# Altium project NBP6 Altera Stratix BGA780 Rev1.00.PrjPcb
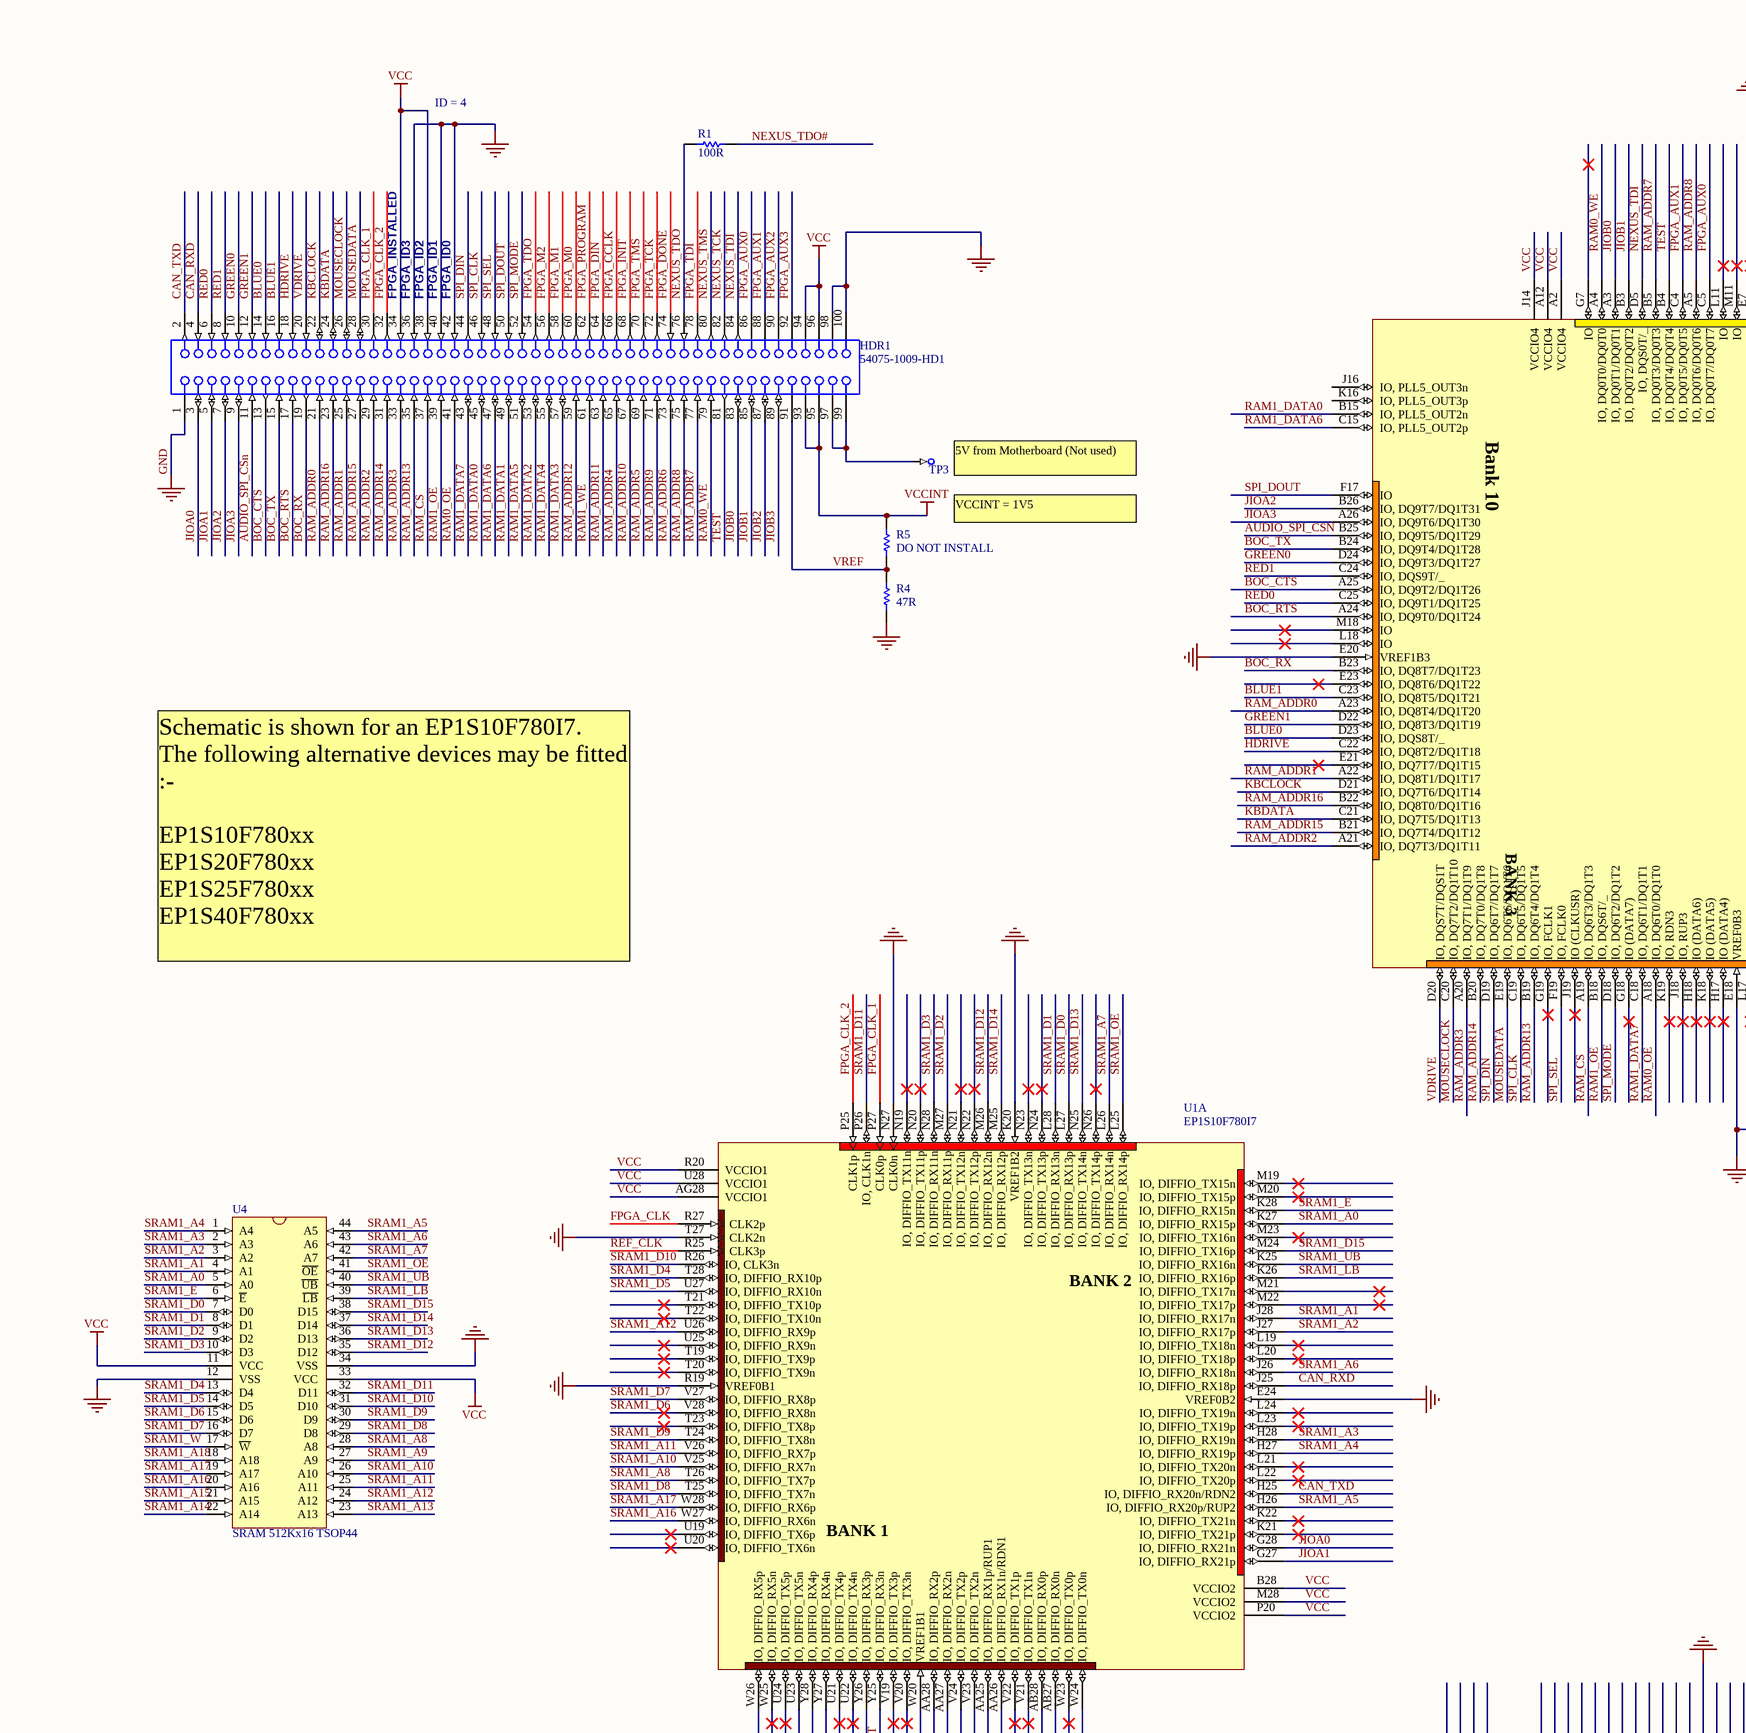
[diagram p0: NBP6 Altera Stratix BGA780 Rev1.00.SchDoc, top left]
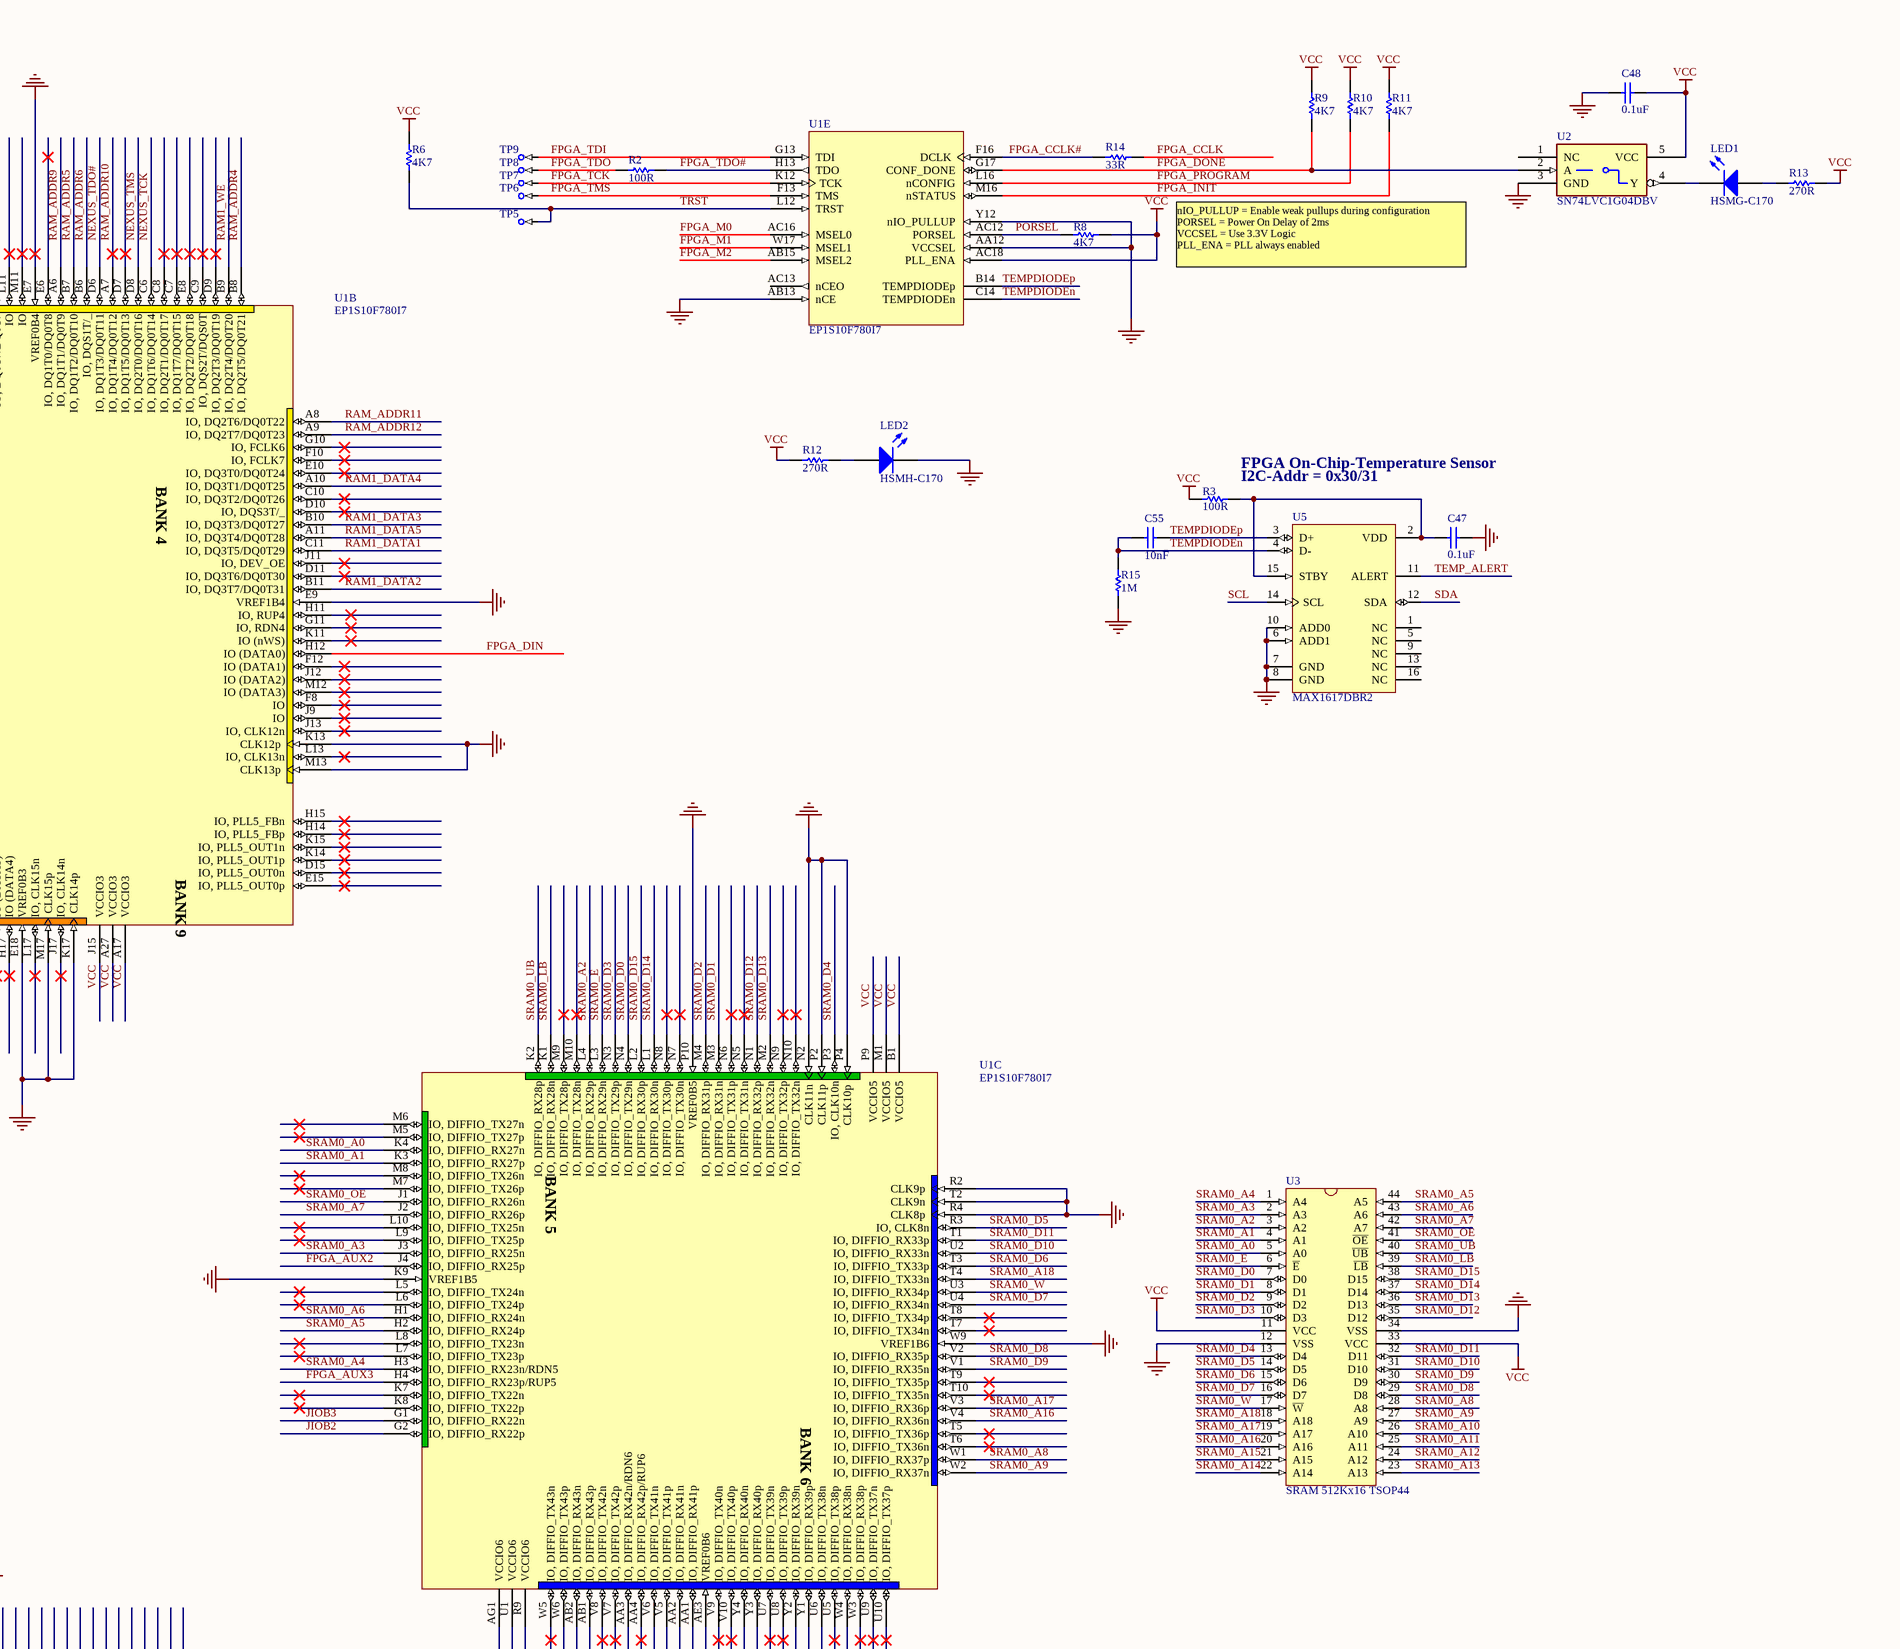
[diagram p1: NBP6 Altera Stratix BGA780 Rev1.00.SchDoc, top right]
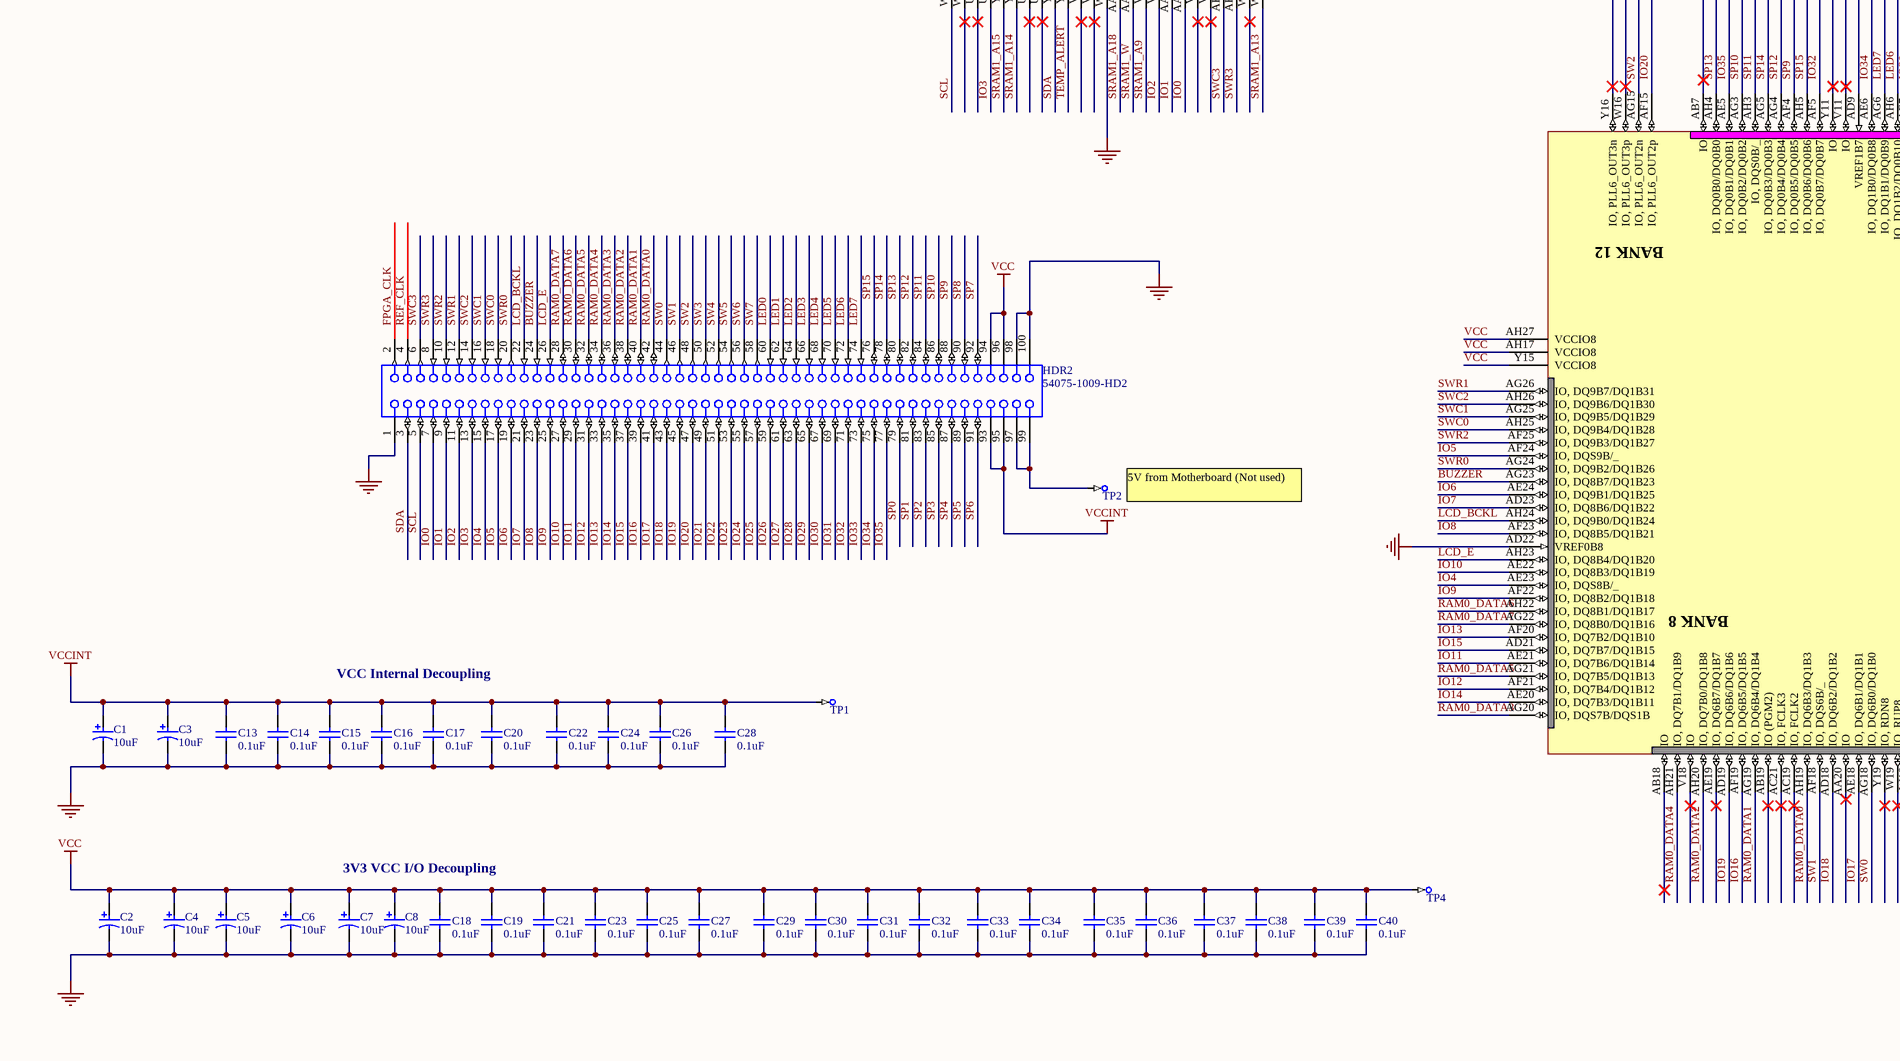
[diagram p2: NBP6 Altera Stratix BGA780 Rev1.00.SchDoc, bottom left]
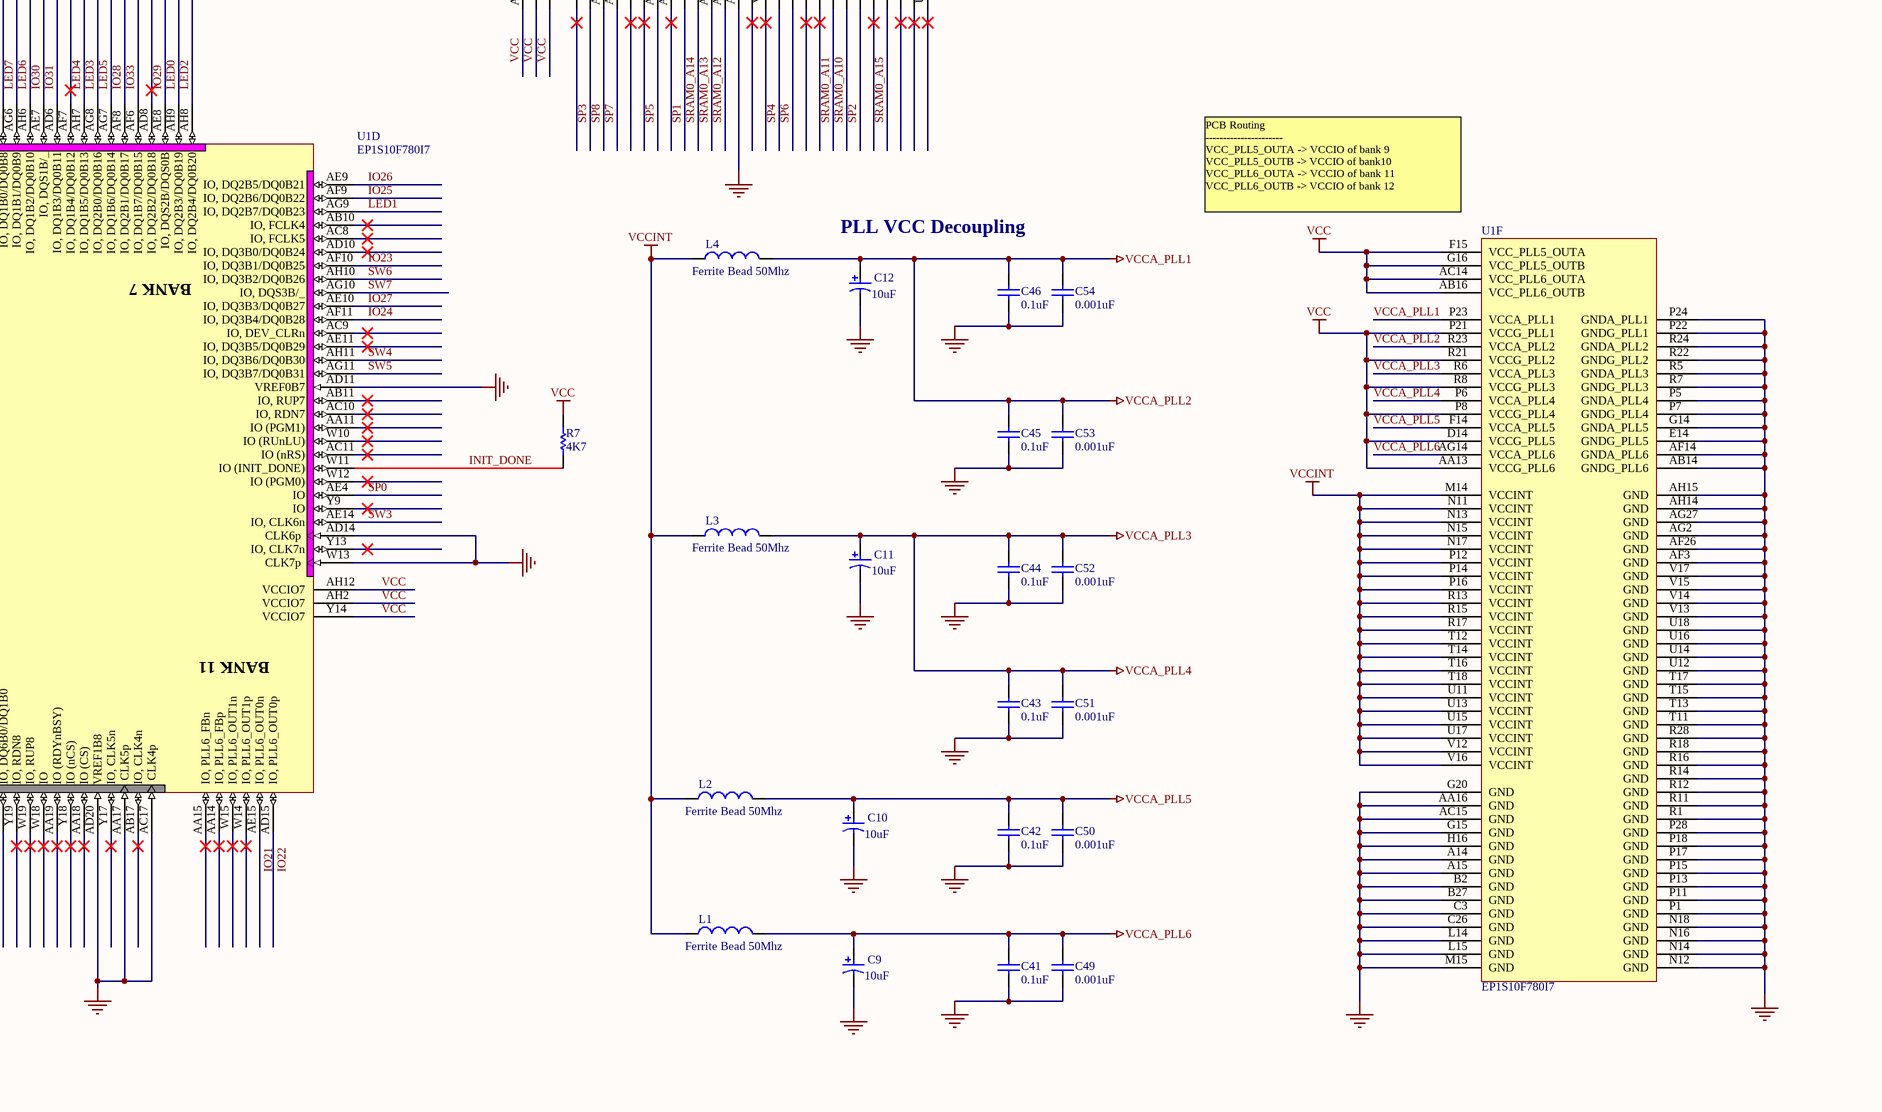
[diagram p3: NBP6 Altera Stratix BGA780 Rev1.00.SchDoc, bottom right]
1 sheet, 92 parts. Net scope: global (net labels, ports and power ports of the same name join across sheets).
Board file: NBP6 Altera Stratix BGA780 Rev1.00.PcbDoc

## Sheet NBP6 Altera Stratix BGA780 Rev1.00.SchDoc: Cyclone EP1C12 Daughterboard
size A1; Organization: Altium Limited; Address1: L3, 12a Rodborough Rd; Address2: Frenchs Forest; Address3: NSW; Address4: Australia 2086; DocumentNumber: 1; Revision: 1.02; SheetNumber: 1; SheetTotal: 1

### Parts
C1  10uF  [MCCT-B]
C2  10uF  [MCCT-B]
C3  10uF  [MCCT-B]
C4  10uF  [MCCT-B]
C5  10uF  [MCCT-B]
C6  10uF  [MCCT-B]
C7  10uF  [MCCT-B]
C8  10uF  [MCCT-B]
C9  10uF  [MCCT-B]
C10  10uF  [MCCT-B]
C11  10uF  [MCCT-B]
C12  10uF  [MCCT-B]
C13  0.1uF  [CC2012-0805]
C14  0.1uF  [CC2012-0805]
C15  0.1uF  [CC2012-0805]
C16  0.1uF  [CC2012-0805]
C17  0.1uF  [CC2012-0805]
C18  0.1uF  [CC2012-0805]
C19  0.1uF  [CC2012-0805]
C20  0.1uF  [CC2012-0805]
C21  0.1uF  [CC2012-0805]
C22  0.1uF  [CC2012-0805]
C23  0.1uF  [CC2012-0805]
C24  0.1uF  [CC2012-0805]
C25  0.1uF  [CC2012-0805]
C26  0.1uF  [CC2012-0805]
C27  0.1uF  [CC2012-0805]
C28  0.1uF  [CC2012-0805]
C29  0.1uF  [CC2012-0805]
C30  0.1uF  [CC2012-0805]
C31  0.1uF  [CC2012-0805]
C32  0.1uF  [CC2012-0805]
C33  0.1uF  [CC2012-0805]
C34  0.1uF  [CC2012-0805]
C35  0.1uF  [CC2012-0805]
C36  0.1uF  [CC2012-0805]
C37  0.1uF  [CC2012-0805]
C38  0.1uF  [CC2012-0805]
C39  0.1uF  [CC2012-0805]
C40  0.1uF  [CC2012-0805]
C41  0.1uF  [CC2012-0805]
C42  0.1uF  [CC2012-0805]
C43  0.1uF  [CC2012-0805]
C44  0.1uF  [CC2012-0805]
C45  0.1uF  [CC2012-0805]
C46  0.1uF  [CC2012-0805]
C47  0.1uF  [CC2012-0805]
C48  0.1uF  [CC2012-0805]
C49  0.001uF  [CC2012-0805]
C50  0.001uF  [CC2012-0805]
C51  0.001uF  [CC2012-0805]
C52  0.001uF  [CC2012-0805]
C53  0.001uF  [CC2012-0805]
C54  0.001uF  [CC2012-0805]
C55  10nF  [CC2012-0805]
HDR1  54075-1009-HD1  [54075]
HDR2  54075-1009-HD2  [54075]
L1  Ferrite Bead 50Mhz  [CC2012-0805]
L2  Ferrite Bead 50Mhz  [CC2012-0805]
L3  Ferrite Bead 50Mhz  [CC2012-0805]
L4  Ferrite Bead 50Mhz  [CC2012-0805]
LED1  HSMG-C170  [SMD _LED]
LED2  HSMH-C170  [SMD _LED]
R1  100R  [CC2012-0805]
R2  100R  [CC2012-0805]
R3  100R  [CC2012-0805]
R4  47R  [CC2012-0805]
R5  DO NOT INSTALL  [CC2012-0805]
R6  4K7  [CC2012-0805]
R7  4K7  [CC2012-0805]
R8  4K7  [CC2012-0805]
R9  4K7  [CC2012-0805]
R10  4K7  [CC2012-0805]
R11  4K7  [CC2012-0805]
R12  270R  [CC2012-0805]
R13  270R  [CC2012-0805]
R14  33R  [CC2012-0805]
R15  1M  [CC2012-0805]
TP1  TestPin  [TestPin]  (value not drawn)  (no BOM)
TP2  TestPin  [TestPin]  (value not drawn)  (no BOM)
TP3  TestPin  [TestPin]  (value not drawn)  (no BOM)
TP4  TestPin  [TestPin]  (value not drawn)  (no BOM)
TP5  TestPin  [TestPin]  (value not drawn)  (no BOM)
TP6  TestPin  [TestPin]  (value not drawn)  (no BOM)
TP7  TestPin  [TestPin]  (value not drawn)  (no BOM)
TP8  TestPin  [TestPin]  (value not drawn)  (no BOM)
TP9  TestPin  [TestPin]  (value not drawn)  (no BOM)
U1  EP1S10F780I7  [FBGA780]  (parts A,B,C,D,E,F of 7)
U2  SN74LVC1G04DBV  [SO-G5/P.95]
U3  SRAM 512Kx16 TSOP44  [SO-G44/P.8]
U4  SRAM 512Kx16 TSOP44  [SO-G44/P.8]
U5  MAX1617DBR2  [QSOP16]

### Nets
GND: C1.2 C2.2 C3.2 C4.2 C5.2 C6.2 C7.2 C8.2 C9.2 C10.2 C11.2 C12.2 C13.2 C14.2 C15.2 C16.2 C17.2 C18.2 C19.2 C20.2 C21.2 C22.2 C23.2 C24.2 C25.2 C26.2 C27.2 C28.2 C29.2 C30.2 C31.2 C32.2 C33.2 C34.2 C35.2 C36.2 C37.2 C38.2 C39.2 C40.2 C41.2 C42.2 C43.2 C44.2 C45.2 C46.2 C47.2 C48.2 C49.2 C50.2 C51.2 C52.2 C53.2 C54.2 HDR1.1 HDR1.36 HDR1.40 HDR1.42 HDR1.98 HDR1.100 HDR2.1 HDR2.98 HDR2.100 LED2.2(K) R4.2 R15.1 U1.A14(GND) U1.A15(GND) U1.AA12(VCCSEL) U1.AA16(GND) U1.AA17(CLK5p) U1.AB13(nCE) U1.AB14(GNDG_PLL6) U1.AC15(GND) U1.AC17(CLK4p) U1.AD9(VREF1B7) U1.AD11(VREF0B7) U1.AD14(CLK6p) U1.AD20(VREF1B8) U1.AD22(VREF0B8) U1.AE3(VREF0B6) U1.AF3(GND) U1.AF14(GNDA_PLL6) U1.AF26(GND) U1.AG2(GND) U1.AG27(GND) U1.AH14(GND) U1.AH15(GND) U1.B2(GND) U1.B27(GND) U1.C3(GND) U1.C26(GND) U1.E7(VREF0B4) U1.E9(VREF1B4) U1.E14(GNDG_PLL5) U1.E18(VREF0B3) U1.E20(VREF1B3) U1.E24(VREF0B2) U1.G14(GNDA_PLL5) U1.G15(GND) U1.G20(GND) U1.H16(GND) U1.K9(VREF1B5) U1.K13(CLK12p) U1.K17(CLK14p) U1.K20(VREF1B2) U1.L14(GND) U1.L15(GND) U1.M13(CLK13p) U1.M15(GND) U1.M17(CLK15p) U1.N2(CLK11n) U1.N12(GND) U1.N14(GND) U1.N16(GND) U1.N18(GND) U1.N27(CLK0n) U1.P1(GND) U1.P2(CLK11p) U1.P4(CLK10p) U1.P5(GNDA_PLL4) U1.P7(GNDG_PLL4) U1.P10(VREF0B5) U1.P11(GND) U1.P13(GND) U1.P15(GND) U1.P17(GND) U1.P18(GND) U1.P22(GNDG_PLL1) U1.P24(GNDA_PLL1) U1.P28(GND) U1.R1(GND) U1.R2(CLK9p) U1.R4(CLK8p) U1.R5(GNDA_PLL3) U1.R7(GNDG_PLL3) U1.R11(GND) U1.R12(GND) U1.R14(GND) U1.R16(GND) U1.R18(GND) U1.R19(VREF0B1) U1.R22(GNDG_PLL2) U1.R24(GNDA_PLL2) U1.R28(GND) U1.T2(CLK9n) U1.T11(GND) U1.T13(GND) U1.T15(GND) U1.T17(GND) U1.T27(CLK2n) U1.U12(GND) U1.U14(GND) U1.U16(GND) U1.U18(GND) U1.V13(GND) U1.V14(GND) U1.V15(GND) U1.V17(GND) U1.W9(VREF1B6) U1.W13(CLK7p) U1.W20(VREF1B1) U1.Y12(nIO_PULLUP) U2.3(GND) U3.12(VSS) U3.34(VSS) U4.12(VSS) U4.34(VSS) U5.6(ADD1) U5.7(GND) U5.8(GND) U5.10(ADD0)
VCC: C2.1 C4.1 C5.1 C6.1 C7.1 C8.1 C18.1 C19.1 C21.1 C23.1 C25.1 C27.1 C29.1 C30.1 C31.1 C32.1 C33.1 C34.1 C35.1 C36.1 C37.1 C38.1 C39.1 C40.1 C48.1 HDR1.34 HDR1.38 HDR1.94 HDR1.96 HDR2.94 HDR2.96 R3.1 R6.1 R7.1 R8.2 R9.1 R10.1 R11.1 R12.1 R13.1 TP4.1 U1.A2(VCCIO4) U1.A12(VCCIO4) U1.A17(VCCIO3) U1.A27(VCCIO3) U1.AA13(VCCG_PLL6) U1.AB16(VCC_PLL6_OUTB) U1.AC14(VCC_PLL6_OUTA) U1.AC18(PLL_ENA) U1.AG1(VCCIO6) U1.AG28(VCCIO1) U1.AH2(VCCIO7) U1.AH12(VCCIO7) U1.AH17(VCCIO8) U1.AH27(VCCIO8) U1.B1(VCCIO5) U1.B28(VCCIO2) U1.D14(VCCG_PLL5) U1.F15(VCC_PLL5_OUTA) U1.G16(VCC_PLL5_OUTB) U1.J14(VCCIO4) U1.J15(VCCIO3) U1.M1(VCCIO5) U1.M28(VCCIO2) U1.P8(VCCG_PLL4) U1.P9(VCCIO5) U1.P20(VCCIO2) U1.P21(VCCG_PLL1) U1.R8(VCCG_PLL3) U1.R9(VCCIO6) U1.R20(VCCIO1) U1.R21(VCCG_PLL2) U1.U1(VCCIO6) U1.U28(VCCIO1) U1.Y14(VCCIO7) U1.Y15(VCCIO8) U2.5(VCC) U3.11(VCC) U3.33(VCC) U4.11(VCC) U4.33(VCC)
VCCA_PLL1: C12.1 C45.1 C46.1 C53.1 C54.1 L4.2 U1.P23(VCCA_PLL1) U1.R23(VCCA_PLL2)  [also labelled VCCA_PLL2]
VCCA_PLL3: C11.1 C43.1 C44.1 C51.1 C52.1 L3.2 U1.P6(VCCA_PLL4) U1.R6(VCCA_PLL3)  [also labelled VCCA_PLL4]
VCCA_PLL5: C10.1 C42.1 C50.1 L2.2 U1.F14(VCCA_PLL5)
VCCA_PLL6: C9.1 C41.1 C49.1 L1.2 U1.AG14(VCCA_PLL6)
VCCINT: C1.1 C3.1 C13.1 C14.1 C15.1 C16.1 C17.1 C20.1 C22.1 C24.1 C26.1 C28.1 HDR1.93 HDR1.95 HDR2.93 HDR2.95 L1.1 L2.1 L3.1 L4.1 R5.1 TP1.1 U1.M14(VCCINT) U1.N11(VCCINT) U1.N13(VCCINT) U1.N15(VCCINT) U1.N17(VCCINT) U1.P12(VCCINT) U1.P14(VCCINT) U1.P16(VCCINT) U1.R13(VCCINT) U1.R15(VCCINT) U1.R17(VCCINT) U1.T12(VCCINT) U1.T14(VCCINT) U1.T16(VCCINT) U1.T18(VCCINT) U1.U11(VCCINT) U1.U13(VCCINT) U1.U15(VCCINT) U1.U17(VCCINT) U1.V12(VCCINT) U1.V16(VCCINT)
AUDIO_SPI_CSn: HDR1.11 U1.B25(IO,_DQ9T5/DQ1T29)
BLUE0: HDR1.14 U1.D23(IO,_DQS8T/_)
BLUE1: HDR1.16 U1.C23(IO,_DQ8T5/DQ1T21)
BOC_CTS: HDR1.13 U1.A25(IO,_DQ9T2/DQ1T26)
BOC_RTS: HDR1.17 U1.A24(IO,_DQ9T0/DQ1T24)
BOC_RX: HDR1.19 U1.B23(IO,_DQ8T7/DQ1T23)
BOC_TX: HDR1.15 U1.B24(IO,_DQ9T4/DQ1T28)
BUZZER: HDR2.24 U1.AG23(IO,_DQ8B7/DQ1B23)
CAN_RXD: HDR1.4 U1.J25(IO,_DIFFIO_RX18p)
CAN_TXD: HDR1.2 U1.H25(IO,_DIFFIO_RX20n/RDN2)
FPGA_AUX0: HDR1.86 U1.C5(IO,_DQ0T7/DQ0T7)
FPGA_AUX1: HDR1.88 U1.C4(IO,_DQ0T5/DQ0T5)
FPGA_AUX2: HDR1.90 U1.J4(IO,_DIFFIO_RX25p)
FPGA_AUX3: HDR1.92 U1.H4(IO,_DIFFIO_RX23p/RUP5)
FPGA_CCLK: HDR1.66 R14.2
FPGA_CCLK#: R14.1 U1.F16(DCLK)
FPGA_CLK: HDR2.2 U1.R27(CLK2p)
FPGA_CLK_1: HDR1.30 U1.P27(CLK0p)
FPGA_CLK_2: HDR1.32 U1.P25(CLK1p)
FPGA_DIN: HDR1.64 U1.H12(IO_(DATA0))
FPGA_DONE: HDR1.74 R9.2 U1.G17(CONF_DONE) U2.2(A)
FPGA_INIT: HDR1.68 R11.2 U1.M16(nSTATUS)
FPGA_M0: HDR1.60 U1.AC16(MSEL0)
FPGA_M1: HDR1.58 U1.W17(MSEL1)
FPGA_M2: HDR1.56 U1.AB15(MSEL2)
FPGA_PROGRAM: HDR1.62 R10.2 U1.L16(nCONFIG)
FPGA_TCK: HDR1.72 TP7.1 U1.K12(TCK)
FPGA_TDI: HDR1.78 TP9.1 U1.G13(TDI)
FPGA_TDO: HDR1.54 R2.1 TP8.1
FPGA_TDO#: R2.2 U1.H13(TDO)
FPGA_TMS: HDR1.70 TP6.1 U1.F13(TMS)
GREEN0: HDR1.10 U1.D24(IO,_DQ9T3/DQ1T27)
GREEN1: HDR1.12 U1.D22(IO,_DQ8T3/DQ1T19)
HDRIVE: HDR1.18 U1.C22(IO,_DQ8T2/DQ1T18)
INIT_DONE: R7.2 U1.W11(IO_(INIT_DONE))
IO0: HDR2.7 U1.AA26(IO,_DIFFIO_RX1n/RDN1)
IO1: HDR2.9 U1.AA25(IO,_DIFFIO_RX1p/RUP1)
IO2: HDR2.11 U1.V23(IO,_DIFFIO_TX2n)
IO3: HDR2.13 U1.U23(IO,_DIFFIO_TX5n)
IO4: HDR2.15 U1.AE23(IO,_DQS8B/_)
IO5: HDR2.17 U1.AF24(IO,_DQS9B/_)
IO6: HDR2.19 U1.AE24(IO,_DQ9B1/DQ1B25)
IO7: HDR2.21 U1.AD23(IO,_DQ8B6/DQ1B22)
IO8: HDR2.23 U1.AF23(IO,_DQ8B5/DQ1B21)
IO9: HDR2.25 U1.AF22(IO,_DQ8B2/DQ1B18)
IO10: HDR2.27 U1.AE22(IO,_DQ8B3/DQ1B19)
IO11: HDR2.29 U1.AE21(IO,_DQ7B6/DQ1B14)
IO12: HDR2.31 U1.AF21(IO,_DQ7B4/DQ1B12)
IO13: HDR2.33 U1.AF20(IO,_DQ7B2/DQ1B10)
IO14: HDR2.35 U1.AE20(IO,_DQ7B3/DQ1B11)
IO15: HDR2.37 U1.AD21(IO,_DQ7B7/DQ1B15)
IO16: HDR2.39 U1.AF19(IO,_DQ6B5/DQ1B5)
IO17: HDR2.41 U1.AE18(IO,_DQ6B1/DQ1B1)
IO18: HDR2.43 U1.AD18(IO,_DQ6B2/DQ1B2)
IO19: HDR2.45 U1.AD19(IO,_DQ6B6/DQ1B6)
IO20: HDR2.47 U1.AF15(IO,_PLL6_OUT2p)
IO21: HDR2.49 U1.AE15(IO,_PLL6_OUT0n)
IO22: HDR2.51 U1.AD15(IO,_PLL6_OUT0p)
IO23: HDR2.53 U1.AF10(IO,_DQ3B1/DQ0B25)
IO24: HDR2.55 U1.AF11(IO,_DQ3B4/DQ0B28)
IO25: HDR2.57 U1.AF9(IO,_DQ2B6/DQ0B22)
IO26: HDR2.59 U1.AE9(IO,_DQ2B5/DQ0B21)
IO27: HDR2.61 U1.AE10(IO,_DQ3B3/DQ0B27)
IO28: HDR2.63 U1.AF8(IO,_DQ2B1/DQ0B17)
IO29: HDR2.65 U1.AE8(IO,_DQS2B/DQS0B)
IO30: HDR2.67 U1.AE7(IO,_DQS1B/_)
IO31: HDR2.69 U1.AD6(IO,_DQ1B3/DQ0B11)
IO32: HDR2.71 U1.AF5(IO,_DQ0B7/DQ0B7)
IO33: HDR2.73 U1.AF6(IO,_DQ1B7/DQ0B15)
IO34: HDR2.75 U1.AE6(IO,_DQ1B0/DQ0B8)
IO35: HDR2.77 U1.AE5(IO,_DQ0B1/DQ0B1)
JIOA0: HDR1.3 U1.G28(IO,_DIFFIO_RX21n)
JIOA1: HDR1.5 U1.G27(IO,_DIFFIO_RX21p)
JIOA2: HDR1.7 U1.B26(IO,_DQ9T7/DQ1T31)
JIOA3: HDR1.9 U1.A26(IO,_DQ9T6/DQ1T30)
JIOB0: HDR1.83 U1.A3(IO,_DQ0T1/DQ0T1)
JIOB1: HDR1.85 U1.B3(IO,_DQ0T2/DQ0T2)
JIOB2: HDR1.87 U1.G2(IO,_DIFFIO_RX22p)
JIOB3: HDR1.89 U1.G1(IO,_DIFFIO_RX22n)
KBCLOCK: HDR1.22 U1.D21(IO,_DQ7T6/DQ1T14)
KBDATA: HDR1.24 U1.C21(IO,_DQ7T5/DQ1T13)
LCD_BCKL: HDR2.22 U1.AH24(IO,_DQ9B0/DQ1B24)
LCD_E: HDR2.26 U1.AH23(IO,_DQ8B4/DQ1B20)
LED0: HDR2.60 U1.AH9(IO,_DQ2B3/DQ0B19)
LED1: HDR2.62 U1.AG9(IO,_DQ2B7/DQ0B23)
LED2: HDR2.64 U1.AH8(IO,_DQ2B4/DQ0B20)
LED3: HDR2.66 U1.AG8(IO,_DQ2B0/DQ0B16)
LED4: HDR2.68 U1.AH7(IO,_DQ1B5/DQ0B13)
LED5: HDR2.70 U1.AG7(IO,_DQ1B6/DQ0B14)
LED6: HDR2.72 U1.AH6(IO,_DQ1B2/DQ0B10)
LED7: HDR2.74 U1.AG6(IO,_DQ1B1/DQ0B9)
MOUSECLOCK: HDR1.26 U1.C20(IO,_DQ7T2/DQ1T10)
MOUSEDATA: HDR1.28 U1.E19(IO,_DQ6T6/DQ1T6)
NEXUS_TCK: HDR1.82 U1.C6(IO,_DQ1T6/DQ0T14)
NEXUS_TDI: HDR1.84 U1.D5(IO,_DQS0T/_)
NEXUS_TDO: HDR1.76 R1.1
NEXUS_TDO#: R1.2 U1.D6(IO,_DQ1T3/DQ0T11)
NEXUS_TMS: HDR1.80 U1.D8(IO,_DQ2T0/DQ0T16)
PORSEL: R8.1 U1.AC12(PORSEL)
RAM0_DATA0: HDR2.42 U1.AH19(IO,_DQ6B3/DQ1B3)
RAM0_DATA1: HDR2.40 U1.AG19(IO,_DQ6B4/DQ1B4)
RAM0_DATA2: HDR2.38 U1.AH20(IO,_DQ7B0/DQ1B8)
RAM0_DATA3: HDR2.36 U1.AG20(IO,_DQS7B/DQS1B)
RAM0_DATA4: HDR2.34 U1.AH21(IO,_DQ7B1/DQ1B9)
RAM0_DATA5: HDR2.32 U1.AG21(IO,_DQ7B5/DQ1B13)
RAM0_DATA6: HDR2.30 U1.AH22(IO,_DQ8B1/DQ1B17)
RAM0_DATA7: HDR2.28 U1.AG22(IO,_DQ8B0/DQ1B16)
RAM0_OE: HDR1.41 U1.A18(IO,_DQ6T0/DQ1T0)
RAM0_WE: HDR1.79 U1.A4(IO,_DQ0T0/DQ0T0)
RAM1_DATA0: HDR1.45 U1.B15(IO,_PLL5_OUT2n)
RAM1_DATA1: HDR1.49 U1.C11(IO,_DQ3T5/DQ0T29)
RAM1_DATA2: HDR1.53 U1.B11(IO,_DQ3T7/DQ0T31)
RAM1_DATA3: HDR1.57 U1.B10(IO,_DQ3T3/DQ0T27)
RAM1_DATA4: HDR1.55 U1.A10(IO,_DQ3T1/DQ0T25)
RAM1_DATA5: HDR1.51 U1.A11(IO,_DQ3T4/DQ0T28)
RAM1_DATA6: HDR1.47 U1.C15(IO,_PLL5_OUT2p)
RAM1_DATA7: HDR1.43 U1.C18(IO,_DQ6T1/DQ1T1)
RAM1_OE: HDR1.39 U1.B18(IO,_DQS6T/_)
RAM1_WE: HDR1.61 U1.B9(IO,_DQ2T4/DQ0T20)
RAM_ADDR0: HDR1.21 U1.A23(IO,_DQ8T4/DQ1T20)
RAM_ADDR1: HDR1.25 U1.A22(IO,_DQ8T1/DQ1T17)
RAM_ADDR2: HDR1.29 U1.A21(IO,_DQ7T3/DQ1T11)
RAM_ADDR3: HDR1.33 U1.A20(IO,_DQ7T1/DQ1T9)
RAM_ADDR4: HDR1.65 U1.B8(IO,_DQ2T5/DQ0T21)
RAM_ADDR5: HDR1.69 U1.B7(IO,_DQ1T2/DQ0T10)
RAM_ADDR6: HDR1.73 U1.B6(IO,_DQS1T/_)
RAM_ADDR7: HDR1.77 U1.B5(IO,_DQ0T3/DQ0T3)
RAM_ADDR8: HDR1.75 U1.A5(IO,_DQ0T6/DQ0T6)
RAM_ADDR9: HDR1.71 U1.A6(IO,_DQ1T1/DQ0T9)
RAM_ADDR10: HDR1.67 U1.A7(IO,_DQ1T4/DQ0T12)
RAM_ADDR11: HDR1.63 U1.A8(IO,_DQ2T6/DQ0T22)
RAM_ADDR12: HDR1.59 U1.A9(IO,_DQ2T7/DQ0T23)
RAM_ADDR13: HDR1.35 U1.B19(IO,_DQ6T4/DQ1T4)
RAM_ADDR14: HDR1.31 U1.B20(IO,_DQ7T0/DQ1T8)
RAM_ADDR15: HDR1.27 U1.B21(IO,_DQ7T4/DQ1T12)
RAM_ADDR16: HDR1.23 U1.B22(IO,_DQ8T0/DQ1T16)
RAM_CS: HDR1.37 U1.A19(IO,_DQ6T3/DQ1T3)
RED0: HDR1.6 U1.C25(IO,_DQ9T1/DQ1T25)
RED1: HDR1.8 U1.C24(IO,_DQS9T/_)
REF_CLK: HDR2.4 U1.R25(CLK3p)
SCL: HDR2.5 U1.W26(IO,_DIFFIO_RX5p) U5.14(SCL)
SDA: HDR2.3 U1.Y26(IO,_DIFFIO_RX3p) U5.12(SDA)
SP0: HDR2.79 U1.AE4(IO)
SP1: HDR2.81 U1.V6(IO,_DIFFIO_TX41n)
SP2: HDR2.83 U1.U6(IO,_DIFFIO_TX38n)
SP3: HDR2.85 U1.W6(IO,_DIFFIO_TX43p)
SP4: HDR2.87 U1.Y4(IO,_DIFFIO_RX40n)
SP5: HDR2.89 U1.AA3(IO,_DIFFIO_RX42n/RDN6)
SP6: HDR2.91 U1.Y3(IO,_DIFFIO_RX40p)
SP7: HDR2.92 U1.AB1(IO,_DIFFIO_RX43p)
SP8: HDR2.90 U1.AB2(IO,_DIFFIO_RX43n)
SP9: HDR2.88 U1.AF4(IO,_DQ0B5/DQ0B5)
SP10: HDR2.86 U1.AG3(IO,_DQ0B2/DQ0B2)
SP11: HDR2.84 U1.AH3(IO,_DQS0B/_)
SP12: HDR2.82 U1.AG4(IO,_DQ0B4/DQ0B4)
SP13: HDR2.80 U1.AH4(IO,_DQ0B0/DQ0B0)
SP14: HDR2.78 U1.AG5(IO,_DQ0B3/DQ0B3)
SP15: HDR2.76 U1.AH5(IO,_DQ0B6/DQ0B6)
SPI_CLK: HDR1.46 U1.C19(IO,_DQ6T5/DQ1T5)
SPI_DIN: HDR1.44 U1.D19(IO,_DQ6T7/DQ1T7)
SPI_DOUT: HDR1.50 U1.F17(IO)
SPI_MODE: HDR1.52 U1.D18(IO,_DQ6T2/DQ1T2)
SPI_SEL: HDR1.48 U1.F19(IO,_FCLK0)
SRAM0_A0: U1.K4(IO,_DIFFIO_RX27n) U3.5(A0)
SRAM0_A1: U1.K3(IO,_DIFFIO_RX27p) U3.4(A1)
SRAM0_A2: U1.L4(IO,_DIFFIO_RX29p) U3.3(A2)
SRAM0_A3: U1.J3(IO,_DIFFIO_RX25n) U3.2(A3)
SRAM0_A4: U1.H3(IO,_DIFFIO_RX23n/RDN5) U3.1(A4)
SRAM0_A5: U1.H2(IO,_DIFFIO_RX24p) U3.44(A5)
SRAM0_A6: U1.H1(IO,_DIFFIO_RX24n) U3.43(A6)
SRAM0_A7: U1.J2(IO,_DIFFIO_RX26p) U3.42(A7)
SRAM0_A8: U1.W1(IO,_DIFFIO_RX37p) U3.28(A8)
SRAM0_A9: U1.W2(IO,_DIFFIO_RX37n) U3.27(A9)
SRAM0_A10: U1.Y1(IO,_DIFFIO_RX39p) U3.26(A10)
SRAM0_A11: U1.Y2(IO,_DIFFIO_RX39n) U3.25(A11)
SRAM0_A12: U1.AA1(IO,_DIFFIO_RX41p) U3.24(A12)
SRAM0_A13: U1.AA2(IO,_DIFFIO_RX41n) U3.23(A13)
SRAM0_A14: U1.V5(IO,_DIFFIO_TX41p) U3.22(A14)
SRAM0_A15: U1.W4(IO,_DIFFIO_RX38n) U3.21(A15)
SRAM0_A16: U1.V4(IO,_DIFFIO_RX36n) U3.20(A16)
SRAM0_A17: U1.V3(IO,_DIFFIO_RX36p) U3.19(A17)
SRAM0_A18: U1.T4(IO,_DIFFIO_TX33n) U3.18(A18)
SRAM0_D0: U1.N4(IO,_DIFFIO_TX29n) U3.7(D0)
SRAM0_D1: U1.M3(IO,_DIFFIO_RX31n) U3.8(D1)
SRAM0_D2: U1.M4(IO,_DIFFIO_RX31p) U3.9(D2)
SRAM0_D3: U1.N3(IO,_DIFFIO_TX29p) U3.10(D3)
SRAM0_D4: U1.P3(IO,_CLK10n) U3.13(D4)
SRAM0_D5: U1.R3(IO,_CLK8n) U3.14(D5)
SRAM0_D6: U1.T3(IO,_DIFFIO_TX33p) U3.15(D6)
SRAM0_D7: U1.U4(IO,_DIFFIO_RX34n) U3.16(D7)
SRAM0_D8: U1.V2(IO,_DIFFIO_RX35p) U3.29(D8)
SRAM0_D9: U1.V1(IO,_DIFFIO_RX35n) U3.30(D9)
SRAM0_D10: U1.U2(IO,_DIFFIO_RX33n) U3.31(D10)
SRAM0_D11: U1.T1(IO,_DIFFIO_RX33p) U3.32(D11)
SRAM0_D12: U1.N1(IO,_DIFFIO_RX32p) U3.35(D12)
SRAM0_D13: U1.M2(IO,_DIFFIO_RX32n) U3.36(D13)
SRAM0_D14: U1.L1(IO,_DIFFIO_RX30n) U3.37(D14)
SRAM0_D15: U1.L2(IO,_DIFFIO_RX30p) U3.38(D15)
SRAM0_E: U1.L3(IO,_DIFFIO_RX29n) U3.6(~{E})
SRAM0_LB: U1.K1(IO,_DIFFIO_RX28n) U3.39(~{LB})
SRAM0_OE: U1.J1(IO,_DIFFIO_RX26n) U3.41(~{OE})
SRAM0_UB: U1.K2(IO,_DIFFIO_RX28p) U3.40(~{UB})
SRAM0_W: U1.U3(IO,_DIFFIO_RX34p) U3.17(~{W})
SRAM1_A0: U1.K27(IO,_DIFFIO_RX15p) U4.5(A0)
SRAM1_A1: U1.J28(IO,_DIFFIO_RX17n) U4.4(A1)
SRAM1_A2: U1.J27(IO,_DIFFIO_RX17p) U4.3(A2)
SRAM1_A3: U1.H28(IO,_DIFFIO_RX19n) U4.2(A3)
SRAM1_A4: U1.H27(IO,_DIFFIO_RX19p) U4.1(A4)
SRAM1_A5: U1.H26(IO,_DIFFIO_RX20p/RUP2) U4.44(A5)
SRAM1_A6: U1.J26(IO,_DIFFIO_RX18n) U4.43(A6)
SRAM1_A7: U1.L26(IO,_DIFFIO_RX14n) U4.42(A7)
SRAM1_A8: U1.T26(IO,_DIFFIO_TX7p) U4.28(A8)
SRAM1_A9: U1.V24(IO,_DIFFIO_TX2p) U4.27(A9)
SRAM1_A10: U1.V25(IO,_DIFFIO_RX7n) U4.26(A10)
SRAM1_A11: U1.V26(IO,_DIFFIO_RX7p) U4.25(A11)
SRAM1_A12: U1.U26(IO,_DIFFIO_RX9p) U4.24(A12)
SRAM1_A13: U1.W24(IO,_DIFFIO_TX0n) U4.23(A13)
SRAM1_A14: U1.Y27(IO,_DIFFIO_RX4n) U4.22(A14)
SRAM1_A15: U1.Y28(IO,_DIFFIO_RX4p) U4.21(A15)
SRAM1_A16: U1.W27(IO,_DIFFIO_RX6n) U4.20(A16)
SRAM1_A17: U1.W28(IO,_DIFFIO_RX6p) U4.19(A17)
SRAM1_A18: U1.AA28(IO,_DIFFIO_RX2p) U4.18(A18)
SRAM1_D0: U1.L27(IO,_DIFFIO_RX13p) U4.7(D0)
SRAM1_D1: U1.L28(IO,_DIFFIO_RX13n) U4.8(D1)
SRAM1_D2: U1.M27(IO,_DIFFIO_RX11p) U4.9(D2)
SRAM1_D3: U1.N28(IO,_DIFFIO_RX11n) U4.10(D3)
SRAM1_D4: U1.T28(IO,_DIFFIO_RX10p) U4.13(D4)
SRAM1_D5: U1.U27(IO,_DIFFIO_RX10n) U4.14(D5)
SRAM1_D6: U1.V28(IO,_DIFFIO_RX8n) U4.15(D6)
SRAM1_D7: U1.V27(IO,_DIFFIO_RX8p) U4.16(D7)
SRAM1_D8: U1.T25(IO,_DIFFIO_TX7n) U4.29(D8)
SRAM1_D9: U1.T24(IO,_DIFFIO_TX8n) U4.30(D9)
SRAM1_D10: U1.R26(IO,_CLK3n) U4.31(D10)
SRAM1_D11: U1.P26(IO,_CLK1n) U4.32(D11)
SRAM1_D12: U1.M26(IO,_DIFFIO_RX12n) U4.35(D12)
SRAM1_D13: U1.N25(IO,_DIFFIO_TX14n) U4.36(D13)
SRAM1_D14: U1.M25(IO,_DIFFIO_RX12p) U4.37(D14)
SRAM1_D15: U1.M24(IO,_DIFFIO_TX16p) U4.38(D15)
SRAM1_E: U1.K28(IO,_DIFFIO_RX15n) U4.6(~{E})
SRAM1_LB: U1.K26(IO,_DIFFIO_RX16p) U4.39(~{LB})
SRAM1_OE: U1.L25(IO,_DIFFIO_RX14p) U4.41(~{OE})
SRAM1_UB: U1.K25(IO,_DIFFIO_RX16n) U4.40(~{UB})
SRAM1_W: U1.AA27(IO,_DIFFIO_RX2n) U4.17(~{W})
SW0: HDR2.44 U1.AG18(IO,_DQ6B0/DQ1B0)
SW1: HDR2.46 U1.AF18(IO,_DQS6B/_)
SW2: HDR2.48 U1.AG15(IO,_PLL6_OUT2n)
SW3: HDR2.50 U1.AE14(IO,_CLK6n)
SW4: HDR2.52 U1.AH11(IO,_DQ3B6/DQ0B30)
SW5: HDR2.54 U1.AG11(IO,_DQ3B7/DQ0B31)
SW6: HDR2.56 U1.AH10(IO,_DQ3B2/DQ0B26)
SW7: HDR2.58 U1.AG10(IO,_DQS3B/_)
SWC0: HDR2.18 U1.AH25(IO,_DQ9B4/DQ1B28)
SWC1: HDR2.16 U1.AG25(IO,_DQ9B5/DQ1B29)
SWC2: HDR2.14 U1.AH26(IO,_DQ9B6/DQ1B30)
SWC3: HDR2.6 U1.AB28(IO,_DIFFIO_RX0p)
SWR0: HDR2.20 U1.AG24(IO,_DQ9B2/DQ1B26)
SWR1: HDR2.12 U1.AG26(IO,_DQ9B7/DQ1B31)
SWR2: HDR2.10 U1.AF25(IO,_DQ9B3/DQ1B27)
SWR3: HDR2.8 U1.AB27(IO,_DIFFIO_RX0n)
TEMP_ALERT: U1.Y25(IO,_DIFFIO_RX3n) U5.11(ALERT)
TEMPDIODEn: C55.1 R15.2 U1.C14(TEMPDIODEn) U5.4(D-)
TEMPDIODEp: C55.2 U1.B14(TEMPDIODEp) U5.3(D+)
TEST: HDR1.81 U1.B4(IO,_DQ0T4/DQ0T4)
TRST: R6.2 TP5.1 U1.L12(TRST)
VDRIVE: HDR1.20 U1.D20(IO,_DQS7T/DQS1T)
VREF: HDR1.91 R4.1 R5.2
NetC47_1: C47.1 R3.2 U5.2(VDD) U5.15(STBY)
NetHDR1_97: HDR1.97 HDR1.99 TP3.1
NetHDR2_97: HDR2.97 HDR2.99 TP2.1
NetLED1_1: LED1.1(A) R13.2
NetLED1_2: LED1.2(K) U2.4(Y)
NetLED2_1: LED2.1(A) R12.2

Not connected (* = marked no-connect by the designer): U1 AA4(IO,_DIFFIO_RX42p/RUP6)* AA11(IO_(PGM1))* AA14(IO,_PLL6_FBp)* AA15(IO,_PLL6_FBn)* AA18(IO_(CS))* AA19(IO_(RDYnBSY))* AA20(IO)* AB7(IO)* AB10(IO,_FCLK4)* AB11(IO,_RUP7)* AB17(IO,_CLK4n)* AB18(IO)* AB19(IO_(PGM2))* AC8(IO,_FCLK5)* AC9(IO,_DEV_CLRn)* AC10(IO,_RDN7)* AC11(IO_(nRS))* AC13(nCEO) AC19(IO,_FCLK2)* AC21(IO,_FCLK3)* AD8(IO,_DQ2B2/DQ0B18)* AD10(IO,_DQ3B0/DQ0B24)* AE11(IO,_DQ3B5/DQ0B29)* AE19(IO,_DQ6B7/DQ1B7)* AF7(IO,_DQ1B4/DQ0B12)* C7(IO,_DQ1T7/DQ0T15)* C8(IO,_DQ2T1/DQ0T17)* C9(IO,_DQS2T/DQS0T)* C10(IO,_DQ3T2/DQ0T26)* D7(IO,_DQ1T5/DQ0T13)* D9(IO,_DQ2T3/DQ0T19)* D10(IO,_DQS3T/_)* D11(IO,_DQ3T6/DQ0T30)* D15(IO,_PLL5_OUT0n)* E6(IO,_DQ1T0/DQ0T8)* E8(IO,_DQ2T2/DQ0T18)* E10(IO,_DQ3T0/DQ0T24)* E15(IO,_PLL5_OUT0p)* E21(IO,_DQ7T7/DQ1T15)* E23(IO,_DQ8T6/DQ1T22)* F8(IO)* F10(IO,_FCLK7)* F12(IO_(DATA1))* G7(IO)* G10(IO,_FCLK6)* G11(IO,_RDN4)* G18(IO_(DATA7))* G19(IO,_FCLK1)* H11(IO,_RUP4)* H14(IO,_PLL5_FBp)* H15(IO,_PLL5_FBn)* H17(IO_(DATA4))* H18(IO_(DATA6))* J9(IO)* J11(IO,_DEV_OE)* J12(IO_(DATA2))* J13(IO,_CLK12n)* J16(IO,_PLL5_OUT3n) J17(IO,_CLK14n)* J18(IO,_RUP3)* J19(IO_(CLKUSR))* K7(IO,_DIFFIO_TX22n)* K8(IO,_DIFFIO_TX22p)* K11(IO_(nWS))* K14(IO,_PLL5_OUT1p)* K15(IO,_PLL5_OUT1n)* K16(IO,_PLL5_OUT3p) K18(IO_(DATA5))* K19(IO,_RDN3)* K21(IO,_DIFFIO_TX21p)* K22(IO,_DIFFIO_TX21n)* L5(IO,_DIFFIO_TX24n)* L6(IO,_DIFFIO_TX24p)* L7(IO,_DIFFIO_TX23p)* L8(IO,_DIFFIO_TX23n)* L9(IO,_DIFFIO_TX25p)* L10(IO,_DIFFIO_TX25n)* L11(IO)* L13(IO,_CLK13n)* L17(IO,_CLK15n)* L18(IO)* L19(IO,_DIFFIO_TX18n)* L20(IO,_DIFFIO_TX18p)* L21(IO,_DIFFIO_TX20n)* L22(IO,_DIFFIO_TX20p)* L23(IO,_DIFFIO_TX19p)* L24(IO,_DIFFIO_TX19n)* M5(IO,_DIFFIO_TX27p)* M6(IO,_DIFFIO_TX27n)* M7(IO,_DIFFIO_TX26p)* M8(IO,_DIFFIO_TX26n)* M9(IO,_DIFFIO_TX28p)* M10(IO,_DIFFIO_TX28n)* M11(IO)* M12(IO_(DATA3))* M18(IO)* M19(IO,_DIFFIO_TX15n)* M20(IO,_DIFFIO_TX15p)* M21(IO,_DIFFIO_TX17n)* M22(IO,_DIFFIO_TX17p)* M23(IO,_DIFFIO_TX16n)* N5(IO,_DIFFIO_TX31n)* N6(IO,_DIFFIO_TX31p)* N7(IO,_DIFFIO_TX30n)* N8(IO,_DIFFIO_TX30p)* N9(IO,_DIFFIO_TX32p)* N10(IO,_DIFFIO_TX32n)* N19(IO,_DIFFIO_TX11n)* N20(IO,_DIFFIO_TX11p)* N21(IO,_DIFFIO_TX12n)* N22(IO,_DIFFIO_TX12p)* N23(IO,_DIFFIO_TX13n)* N24(IO,_DIFFIO_TX13p)* N26(IO,_DIFFIO_TX14p)* T5(IO,_DIFFIO_TX36p)* T6(IO,_DIFFIO_TX36n)* T7(IO,_DIFFIO_TX34n)* T8(IO,_DIFFIO_TX34p)* T9(IO,_DIFFIO_TX35p)* T10(IO,_DIFFIO_TX35n)* T19(IO,_DIFFIO_TX9p)* T20(IO,_DIFFIO_TX9n)* T21(IO,_DIFFIO_TX10p)* T22(IO,_DIFFIO_TX10n)* T23(IO,_DIFFIO_TX8p)* U5(IO,_DIFFIO_TX38p)* U7(IO,_DIFFIO_TX39n)* U8(IO,_DIFFIO_TX39p)* U9(IO,_DIFFIO_TX37n)* U10(IO,_DIFFIO_TX37p)* U19(IO,_DIFFIO_TX6p)* U20(IO,_DIFFIO_TX6n)* U21(IO,_DIFFIO_TX4p)* U22(IO,_DIFFIO_TX4n)* U24(IO,_DIFFIO_TX5p)* U25(IO,_DIFFIO_RX9n)* V7(IO,_DIFFIO_TX42p)* V8(IO,_DIFFIO_TX42n)* V9(IO,_DIFFIO_TX40n)* V10(IO,_DIFFIO_TX40p)* V11(IO)* V18(IO)* V19(IO,_DIFFIO_TX3p)* V20(IO,_DIFFIO_TX3n)* V21(IO,_DIFFIO_TX1n)* V22(IO,_DIFFIO_TX1p)* W3(IO,_DIFFIO_RX38p)* W5(IO,_DIFFIO_TX43n)* W10(IO_(RUnLU))* W12(IO_(PGM0))* W14(IO,_PLL6_OUT1p)* W15(IO,_PLL6_OUT1n)* W16(IO,_PLL6_OUT3p)* W18(IO)* W19(IO,_RUP8)* W23(IO,_DIFFIO_TX0p)* W25(IO,_DIFFIO_RX5n)* Y9(IO)* Y11(IO)* Y13(IO,_CLK7n)* Y16(IO,_PLL6_OUT3n)* Y17(IO,_CLK5n)* Y18(IO_(nCS))* Y19(IO,_RDN8)*; U2 1(NC); U5 1(NC) 5(NC) 9(NC) 13(NC) 16(NC)

### Notes on the sheet
- ID = 4
- (near HDR1) FPGA_INSTALLED
- (near HDR1) FPGA_ID3
- (near HDR1) FPGA_ID2
- (near HDR1) FPGA_ID1
- (near HDR1) FPGA_ID0
- nIO_PULLUP = Enable weak pullups during configuration
  PORSEL = Power On Delay of 2ms
  VCCSEL = Use 3.3V Logic
  PLL_ENA = PLL always enabled
- (near TP3) 5V from Motherboard (Not used)
- (near R3) FPGA On-Chip-Temperature Sensor
- (near R3) I2C-Addr = 0x30/31
- VCCINT = 1V5
- Schematic is shown for an EP1S10F780I7.  The following alternative devices may be fitted :-
  EP1S10F780xx
  EP1S20F780xx
  EP1S25F780xx
  EP1S40F780xx
- (near U1) PCB Routing
  ----------------------
  VCC_PLL5_OUTA -> VCCIO of bank 9
  VCC_PLL5_OUTB -> VCCIO of bank10
  VCC_PLL6_OUTA -> VCCIO of bank 11
  VCC_PLL6_OUTB -> VCCIO of bank 12
- PLL VCC Decoupling
- (near TP2) 5V from Motherboard (Not used)
- VCC Internal Decoupling
- 3V3 VCC I/O Decoupling
- Title
- Size:
- Date:
- File:
- D
- Number:
- Time:
- Revision:
- Sheet
- of
- (in symbol EP1S10F780I7, part A) BANK 2; BANK 1
- (in symbol EP1S10F780I7, part B) Bank 10; BANK 4; BANK 3; BANK 9
- (in symbol EP1S10F780I7, part C) BANK 5; BANK 6
- (in symbol EP1S10F780I7, part D) BANK 12; BANK 7; BANK 8; BANK 11

### Library data of the parts
C1-C12 = CAP_POLAR: Polar Capacitor; Supplier: FARNELL; Supplier Code: 967-117
C13-C55 = CAP: Capacitor; Supplier: FARNELL
  C13-C48: Supplier Code: 499-687
  C49-C55: Supplier Code: 383-4980
HDR1 = 54075-1009-HD1: Board-to-Board, Docking Station, 0.80mm (.031") Pitch, Shielded Receptacle, Vertical, Ultra Low Profile, SMT; Manufacturer: Molex; Package Information: Latest Revision: Jun-2001; Mating Height: 8.5mm; Voltage: 100V; Current: 0.5A; Contact Resistance: 40mOhm max; PCB Layout: Complies with Manufacturer's Recommendation.; Published: 15-Oct-2003; Datasheet: Latest Revision: Feb-2002; Package Reference: 54075; Publisher: Altium Limited; Supplier: *
HDR2 = 54075-1009-HD2: Board-to-Board, Docking Station, 0.80mm (.031") Pitch, Shielded Receptacle, Vertical, Ultra Low Profile, SMT; Manufacturer: Molex; Package Information: Latest Revision: Jun-2001; Mating Height: 8.5mm; Voltage: 100V; Current: 0.5A; Contact Resistance: 40mOhm max; PCB Layout: Complies with Manufacturer's Recommendation.; Published: 15-Oct-2003; Datasheet: Latest Revision: Feb-2002; Package Reference: 54075; Publisher: Altium Limited; Supplier: *
L1-L4 = Inductor: Ferrite Bead; Value: 10mH; Published: 8-Jun-2000; Revision: July-2002: Re-released for DXP Platform.; Publisher: Altium Limited; Supplier: FARNELL; Supplier Code: 323-7989
LED1 LED2 = HSMX-C670: Typical RED GaAs SMD LED Agilent make; Manufacturer: Generic Components; Class I: Optoelectronic; Fitted: True; Published: 8-Jun-2000; Revision: July-2002: Re-released for DXP Platform.; Publisher: Altium Limited; Class II: LED
R1-R15 = RES: Resistor
U1 = EP1S10F780I7: Stratix 1.5V FPGA, 426 I/Os, 780-Pin FineLine BGA, Speed Grade 7, Industrial Grade; Package Information: Latest Revision: ver11.0, Feb-2003; DQS signal pins: Banks 3, 4, 7 & 8 named according to DQ bus modes. A "/" separates each mode. ie. Mode x8 / Mode x32.; Code - JEDEC: MS-034-AAM-1; Published: 17-Sep-2003; Datasheet: Latest Revision: ver2.2, Nov-2003; Package Reference: FBGA780; Publisher: Altium Limited
U2 = SN74AHC1G04DBVR: Manufacturer: TI; Fitted: True
U3 U4 = SRAM 512Kx16 TSOP44: 512Kx16Bit SRAM TSOP44
U5 = MAX1617DBR2: SMBus Temperature Sensor with Internal and External Diode Input; Package Information: Latest Revision: Feb-2000; Published: 17-Jul-2002; Datasheet: Latest Revision: Feb-2000; Package Reference: QSOP16; Publisher: Altium Limited